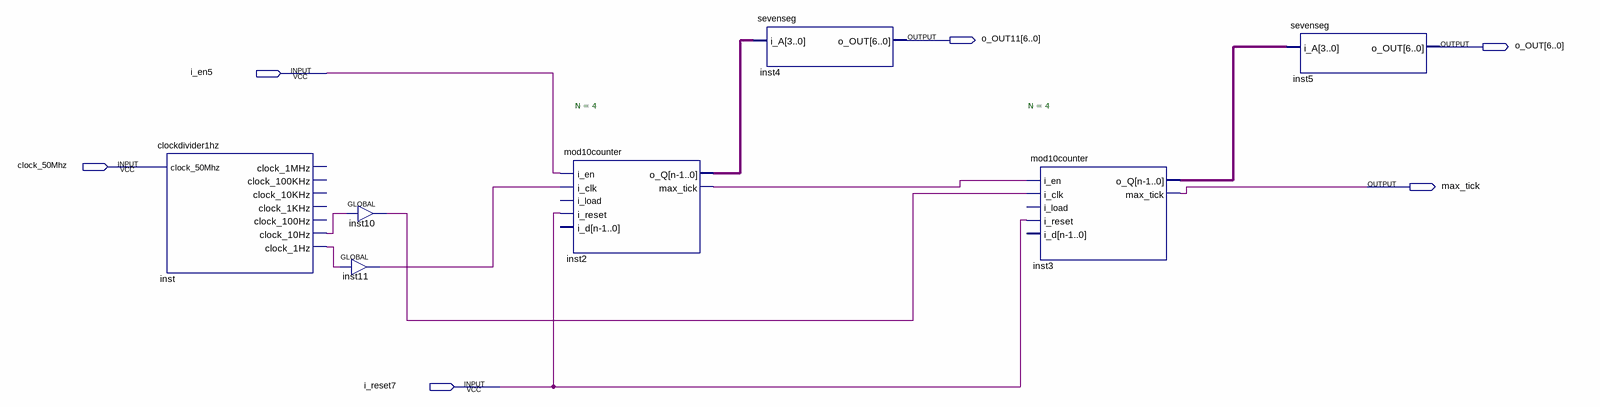
[diagram p0: schematic sheet]
// Quartus schematic graphicalstopwatch.bdf as structural Verilog: 7 symbols, 6 pins
module graphicalstopwatch (
  input  i_en5,
  input  clock_50Mhz,
  input  i_reset7,
  output [6:0] o_OUT11,
  output [6:0] o_OUT,
  output max_tick
);

  wire inst2_max_tick, inst10_out, inst11_out, inst_clock_1hz, inst_clock_10hz;
  wire [3:0] inst2_o_q, inst3_o_q;

  clockdivider1hz inst (
    .clock_50Mhz(clock_50Mhz), .clock_10Hz(inst_clock_10hz), .clock_1Hz(inst_clock_1hz));  // open: clock_1MHz, clock_100KHz, clock_10KHz, clock_1KHz, clock_100Hz
  GLOBAL inst10 (.IN(inst_clock_10hz), .OUT(inst10_out));
  GLOBAL inst11 (.IN(inst_clock_1hz), .OUT(inst11_out));
  mod10counter #(.N(4)) inst2 (
    .i_en(i_en5), .i_clk(inst11_out), .i_reset(i_reset7), .o_Q(inst2_o_q), .max_tick(inst2_max_tick));  // open: i_load, i_d
  sevenseg inst4 (.i_A(inst2_o_q), .o_OUT(o_OUT11));
  mod10counter #(.N(4)) inst3 (
    .i_en(inst2_max_tick), .i_clk(inst10_out), .i_reset(i_reset7), .o_Q(inst3_o_q), .max_tick(max_tick));  // open: i_load, i_d
  sevenseg inst5 (.i_A(inst3_o_q), .o_OUT(o_OUT));
endmodule
